# EAGLE schematic vu_meter (EAGLE 8.3.2)
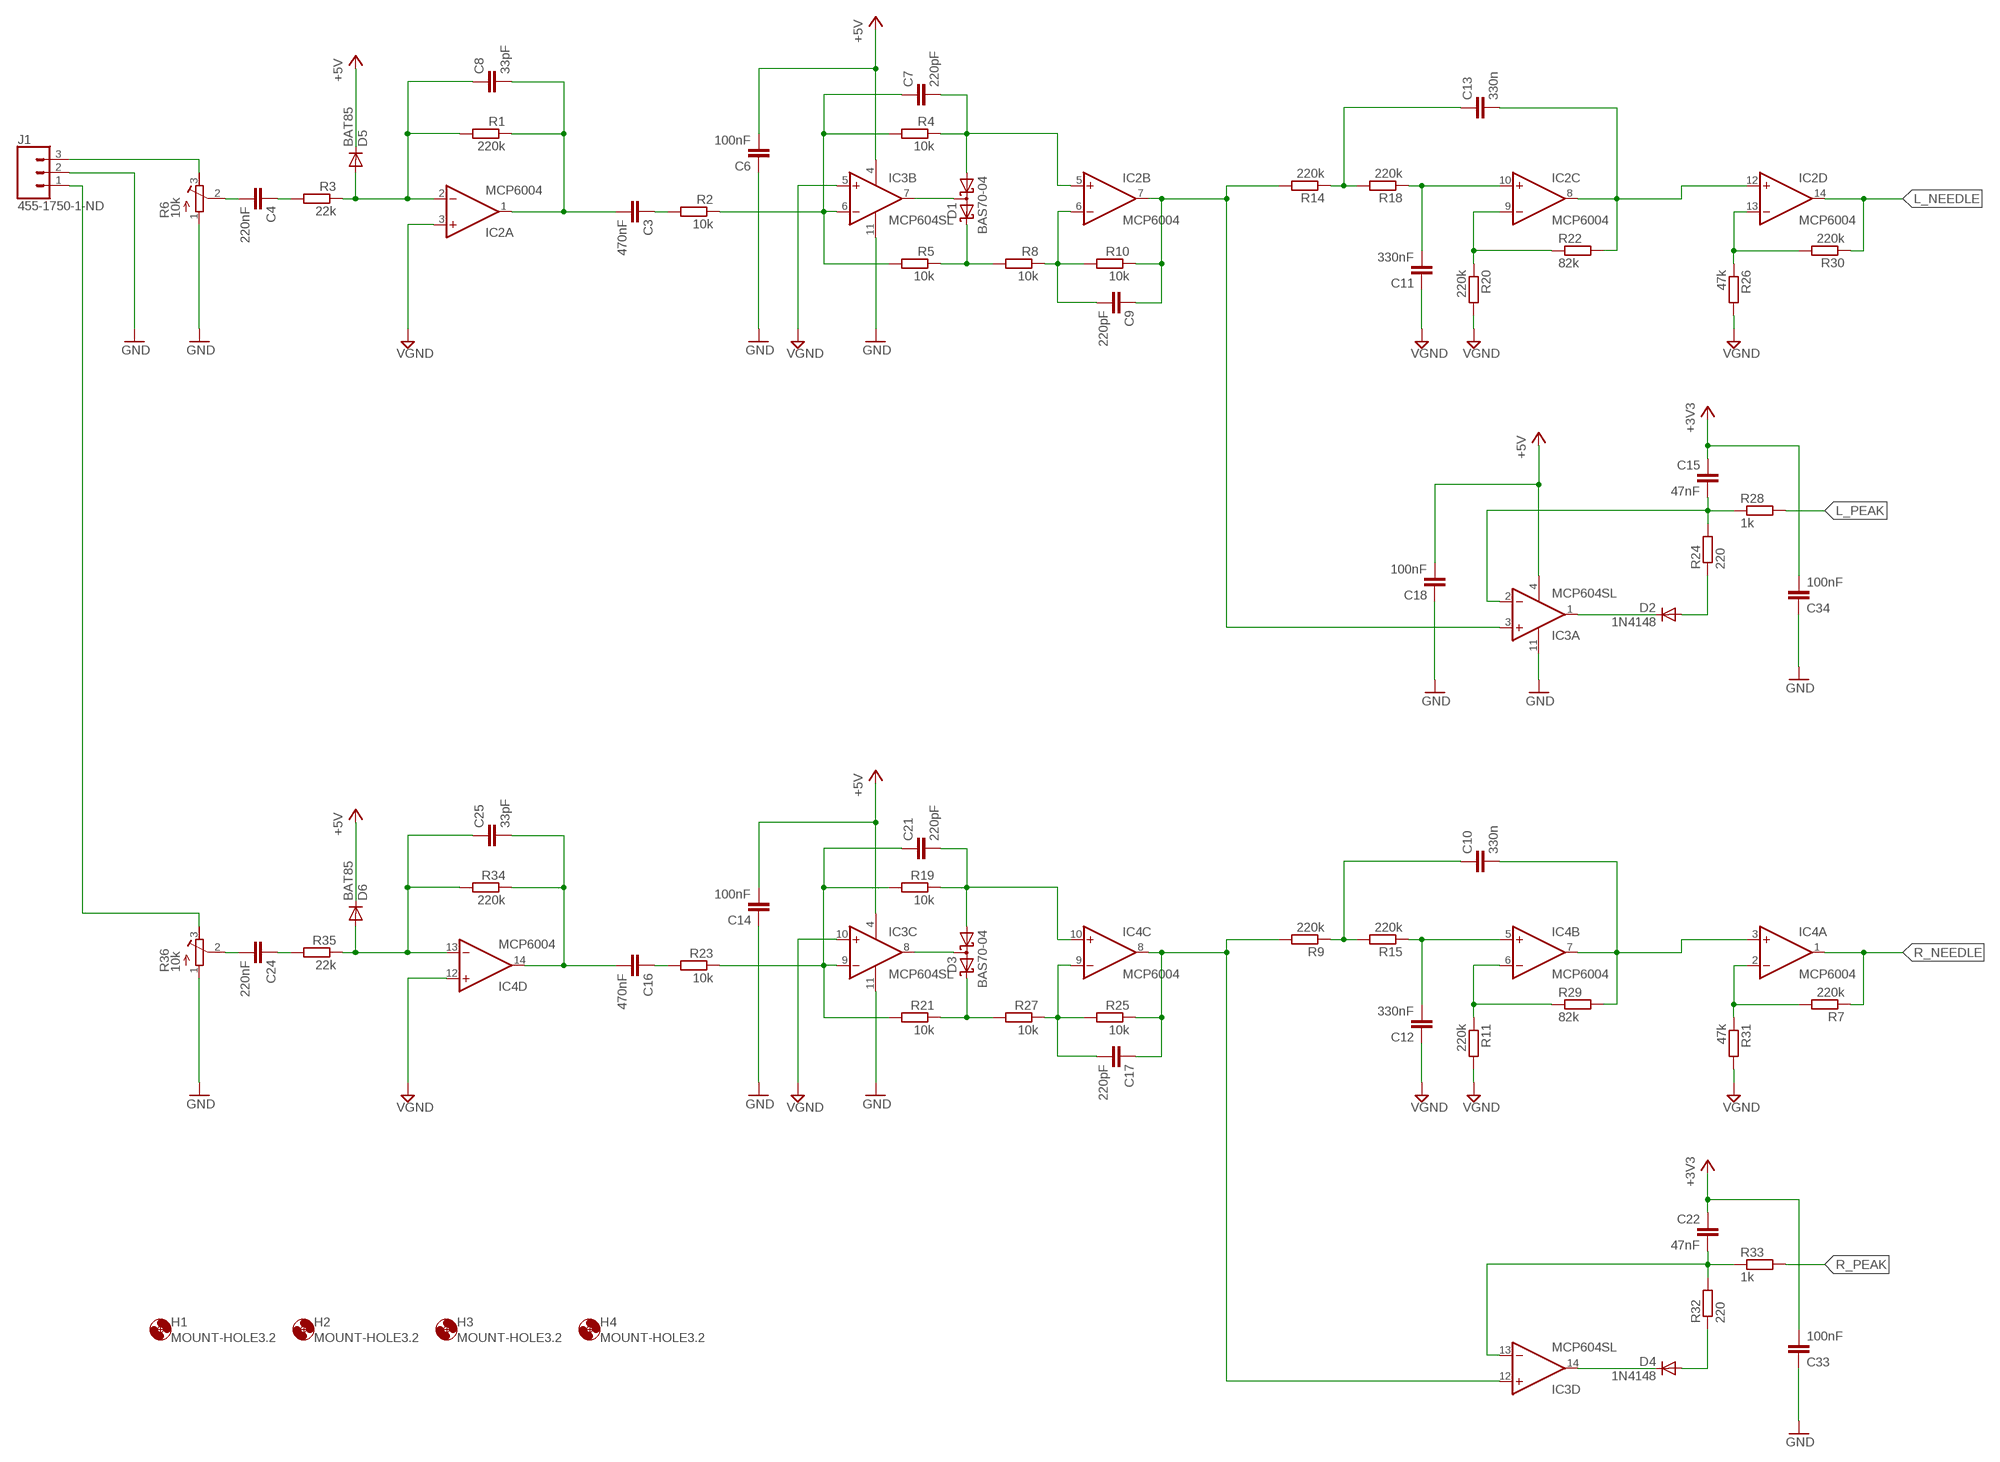
[diagram p0: schematic, sheet 1, part 1 of 2]
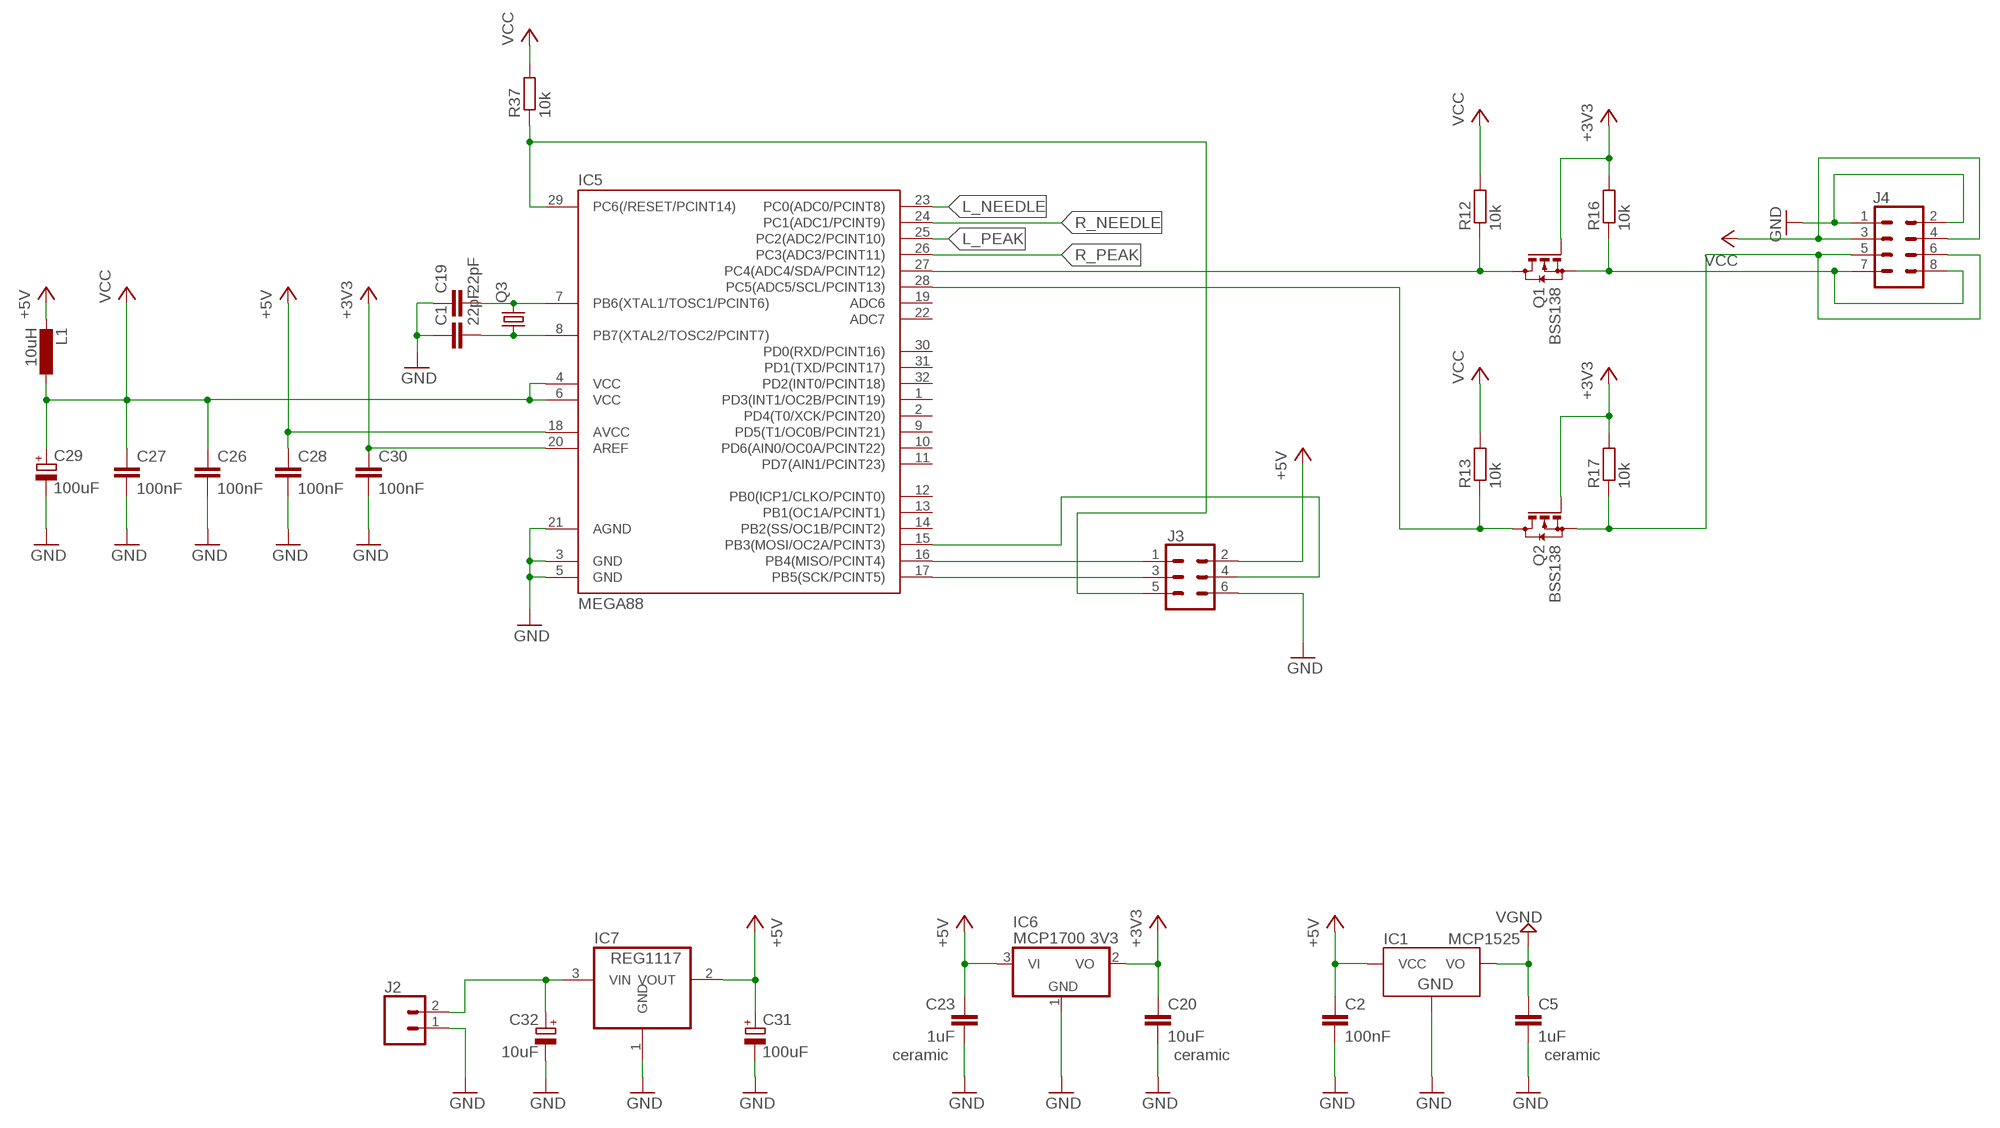
[diagram p1: schematic, sheet 1, part 2 of 2]

## Parts
C1  22pF  C-EUC0805  [C0805]
C2  100nF  C-EUC0805  [C0805]
C3  470nF  C-EUC0805  [C0805]
C4  220nF  C-EUC0805  [C0805]
C5  1uF  C-EUC0805  [C0805]
C6  100nF  C-EUC0805  [C0805]
C7  220pF  C-EUC0805  [C0805]
C8  33pF  C-EUC0805  [C0805]
C9  220pF  C-EUC0805  [C0805]
C10  330n  C-EUC0805  [C0805]
C11  330nF  C-EUC0805  [C0805]
C12  330nF  C-EUC0805  [C0805]
C13  330n  C-EUC0805  [C0805]
C14  100nF  C-EUC0805  [C0805]
C15  47nF  C-EUC0805  [C0805]
C16  470nF  C-EUC0805  [C0805]
C17  220pF  C-EUC0805  [C0805]
C18  100nF  C-EUC0805  [C0805]
C19  22pF  C-EUC0805  [C0805]
C20  10uF  C-EUC0805  [C0805]
C21  220pF  C-EUC0805  [C0805]
C22  47nF  C-EUC0805  [C0805]
C23  1uF  C-EUC0805  [C0805]
C24  220nF  C-EUC0805  [C0805]
C25  33pF  C-EUC0805  [C0805]
C26  100nF  C-EUC0805  [C0805]
C27  100nF  C-EUC0805  [C0805]
C28  100nF  C-EUC0805  [C0805]
C29  100uF  CPOL-EUB/3528-21R  [B/3528-21R]
C30  100nF  C-EUC0805  [C0805]
C31  100uF  CPOL-EUB/3528-21R  [B/3528-21R]
C32  10uF  CPOL-EUB/3528-21R  [B/3528-21R]
C33  100nF  C-EUC0805  [C0805]
C34  100nF  C-EUC0805  [C0805]
D1  BAS70-04  [SOT23]
D2  1N4148  DIODE-MINIMELF  [MINIMELF]
D3  BAS70-04  [SOT23]
D4  1N4148  DIODE-MINIMELF  [MINIMELF]
D5  BAT85  DIODE-MINIMELF  [MINIMELF]
D6  BAT85  DIODE-MINIMELF  [MINIMELF]
H1  MOUNT-HOLE3.2  [3,2]
H2  MOUNT-HOLE3.2  [3,2]
H3  MOUNT-HOLE3.2  [3,2]
H4  MOUNT-HOLE3.2  [3,2]
IC1  MCP1525  MCP9700SMD  [SOT23-3]
IC2  MCP6004  MCP604SL  [SO14]
IC3  MCP604SL  [SO14]
IC4  MCP6004  MCP604SL  [SO14]
IC5  MEGA88  MEGA48/88/168-AU  [TQFP32-08]
IC6  MCP1700 3V3  MCP1703CB  [SOT23]
IC7  REG1117  [SOT223]
J1  455-1750-1-ND  CONN_03  [1X03]
J2  CONN_02  [1X02]
J3  CONN_03X22X3_SILK_MALE_PTH  [2X3]
J4  CONN_04X2  [2X4]
L1  10uH  L-EUL3216C  [L3216C]
Q1  BSS138  BSS123  [SOT23]
Q2  BSS138  BSS123  [SOT23]
Q3  CRYSTALHC49S  [HC49/S]
R1  220k  R-EU_R0805  [R0805]
R2  10k  R-EU_R0805  [R0805]
R3  22k  R-EU_R0805  [R0805]
R4  10k  R-EU_R0805  [R0805]
R5  10k  R-EU_R0805  [R0805]
R6  10k  R-TRIMM3296W  [RTRIM3296W]
R7  220k  R-EU_M0805  [M0805]
R8  10k  R-EU_R0805  [R0805]
R9  220k  R-EU_M0805  [M0805]
R10  10k  R-EU_R0805  [R0805]
R11  220k  R-EU_R0805  [R0805]
R12  10k  R-EU_R0805  [R0805]
R13  10k  R-EU_R0805  [R0805]
R14  220k  R-EU_M0805  [M0805]
R15  220k  R-EU_R0805  [R0805]
R16  10k  R-EU_R0805  [R0805]
R17  10k  R-EU_R0805  [R0805]
R18  220k  R-EU_R0805  [R0805]
R19  10k  R-EU_R0805  [R0805]
R20  220k  R-EU_R0805  [R0805]
R21  10k  R-EU_R0805  [R0805]
R22  82k  R-EU_R0805  [R0805]
R23  10k  R-EU_R0805  [R0805]
R24  220  R-EU_R0805  [R0805]
R25  10k  R-EU_R0805  [R0805]
R26  47k  R-EU_M0805  [M0805]
R27  10k  R-EU_R0805  [R0805]
R28  1k  R-EU_R0805  [R0805]
R29  82k  R-EU_R0805  [R0805]
R30  220k  R-EU_M0805  [M0805]
R31  47k  R-EU_M0805  [M0805]
R32  220  R-EU_R0805  [R0805]
R33  1k  R-EU_R0805  [R0805]
R34  220k  R-EU_R0805  [R0805]
R35  22k  R-EU_R0805  [R0805]
R36  10k  R-TRIMM3296W  [RTRIM3296W]
R37  10k  R-EU_R0805  [R0805]

## Nets
+3V3: C15.1 C20.1 C22.1 C30.1 C33.2 C34.2 IC5.20(AREF) IC6.2(VO) Q1.1(G) Q2.1(G) R16.2 R17.2
+5V: C2.1 C6.2 C14.2 C18.2 C23.1 C28.1 C31.+ D5.C D6.C IC1.1(VCC) IC2.4(P:V+) IC3.4(P:V+) IC4.4(P:V+) IC5.18(AVCC) IC6.3(VI) IC7.2(VOUT) J3.2 L1.2
GND: C1.1 C2.2 C5.2 C6.1 C14.1 C18.1 C19.1 C20.2 C23.2 C26.2 C27.2 C28.2 C29.- C30.2 C31.- C32.- C33.1 C34.1 IC1.3(GND) IC2.11(P:V-) IC3.11(P:V-) IC4.11(P:V-) IC5.3(GND) IC5.5(GND) IC5.21(AGND) IC6.1(GND) IC7.1(GND) J1.2 J2.1 J3.6 J4.1 J4.2 R6.1(A) R36.1(A)
GND1: C5.1 C11.1 C12.1 IC1.2(VO) IC2.3(A:+IN) IC3.5(B:+IN) IC3.10(C:+IN) IC4.12(D:+IN) R11.2 R20.2 R26.2 R31.2 ; supply symbol labelled VGND
IN: J1.3 R6.3(E)
IN1: J1.1 R36.3(E)
L_NEEDLE: IC2.14(D:OUT) IC5.23(PC0(ADC0/PCINT8)) R30.1
L_PEAK: IC5.25(PC2(ADC2/PCINT10)) R28.2
N$1: IC2.13(D:-IN) R26.1 R30.2
N$2: IC4.2(A:-IN) R7.2 R31.1
N$4: C8.1 D5.A IC2.2(A:-IN) R1.2 R3.1
N$5: C4.1 R3.2
N$7: C12.2 IC4.5(B:+IN) R15.1
N$8: C4.2 R6.2(S)
N$9: C13.1 R14.1 R18.2
N$10: C13.2 IC2.8(C:OUT) IC2.12(D:+IN) R22.2
N$11: IC4.6(B:-IN) R11.1 R29.1
N$12: D3.2(C2) R21.1 R27.2
N$13: C21.1 IC3.9(C:-IN) R19.2 R21.2 R23.1
N$14: C11.2 IC2.10(C:+IN) R18.1
N$15: IC2.9(C:-IN) R20.1 R22.1
N$16: D1.2(C2) R5.1 R8.2
N$17: C21.2 D3.1(A1) IC4.10(C:+IN) R19.1
N$18: C3.2 C8.2 IC2.1(A:OUT) R1.1
N$19: C7.1 IC3.6(B:-IN) R2.1 R4.2 R5.2
N$20: D2.C IC3.1(A:OUT)
N$21: D3.3(C1A2) IC3.8(C:OUT)
N$22: C17.2 IC4.9(C:-IN) R25.2 R27.1
N$23: C16.2 C25.2 IC4.14(D:OUT) R34.1
N$24: C16.1 R23.2
N$25: C7.2 D1.1(A1) IC2.5(B:+IN) R4.1
N$26: D1.3(C1A2) IC3.7(B:OUT)
N$27: C9.2 IC2.6(B:-IN) R8.1 R10.2
N$28: C10.1 R9.1 R15.2
N$29: C10.2 IC4.3(A:+IN) IC4.7(B:OUT) R29.2
N$30: C22.2 IC3.13(D:-IN) R32.2 R33.1
N$31: D4.A R32.1
N$32: C17.1 IC3.12(D:+IN) IC4.8(C:OUT) R9.2 R25.1
N$33: D4.C IC3.14(D:OUT)
N$34: C25.1 D6.A IC4.13(D:-IN) R34.2 R35.1
N$35: C24.1 R35.2
N$36: C24.2 R36.2(S)
N$37: C19.2 IC5.7(PB6(XTAL1/TOSC1/PCINT6)) Q3.2
N$38: C1.2 IC5.8(PB7(XTAL2/TOSC2/PCINT7)) Q3.1
N$39: IC5.15(PB3(MOSI/OC2A/PCINT3)) J3.4
N$40: C3.1 R2.2
N$41: IC5.17(PB5(SCK/PCINT5)) J3.3
N$42: IC5.16(PB4(MISO/PCINT4)) J3.1
N$43: IC5.29(PC6(/RESET/PCINT14)) J3.5 R37.1
N$44: C15.2 IC3.2(A:-IN) R24.2 R28.1
N$45: D2.A R24.1
N$47: C32.+ IC7.3(VIN) J2.2
N$48: C9.1 IC2.7(B:OUT) IC3.3(A:+IN) R10.1 R14.2
R_NEEDLE: IC4.1(A:OUT) IC5.24(PC1(ADC1/PCINT9)) R7.1
R_PEAK: IC5.26(PC3(ADC3/PCINT11)) R33.2
SCL: J4.5 J4.6 Q2.2(S) R17.1
SCL1: IC5.28(PC5(ADC5/SCL/PCINT13)) Q2.3(D) R13.1
SDA: J4.7 J4.8 Q1.2(S) R16.1
SDA1: IC5.27(PC4(ADC4/SDA/PCINT12)) Q1.3(D) R12.1
VCC: C26.1 C27.1 C29.+ IC5.4(VCC) IC5.6(VCC) J4.3 J4.4 L1.1 R12.2 R13.2 R37.2
Unconnected: IC5.1(PD3(INT1/OC2B/PCINT19)) IC5.2(PD4(T0/XCK/PCINT20)) IC5.9(PD5(T1/OC0B/PCINT21)) IC5.10(PD6(AIN0/OC0A/PCINT22)) IC5.11(PD7(AIN1/PCINT23)) IC5.12(PB0(ICP1/CLKO/PCINT0)) IC5.13(PB1(OC1A/PCINT1)) IC5.14(PB2(SS/OC1B/PCINT2)) IC5.19(ADC6) IC5.22(ADC7) IC5.30(PD0(RXD/PCINT16)) IC5.31(PD1(TXD/PCINT17)) IC5.32(PD2(INT0/PCINT18))

## Library data of the parts
C1-C4 C6-C19 C21 C22 C24-C28 C30 C33 C34 = rcl:C-EU: CAPACITOR, European symbol
C5 C20 C23 = rcl:C-EU: CAPACITOR, European symbol; TYPE: ceramic
C29 C31 C32 = rcl:CPOL-EU: POLARIZED CAPACITOR, European symbol
D1 D3 = diode:BAS70-04: Silicon Schottky Diodes General-purpose diode for high-speed switching
D2 D4-D6 = diode:DIODE-: DIODE
H1-H4 = holes:MOUNT-HOLE: MOUNTING HOLE with drill center marker
IC1 = SparkFun:MCP9700
IC2-IC4 = linear:MCP604: Quad Op Amp 2.7V to 6.0V Single Supply CMOS Source: http://ww1.microchip.com/downloads/en/DeviceDoc/21314g.pdf
IC5 = avr-7:MEGA48/88/168
IC6 = linear:MCP1703: 250 mA, 16V, Low Quiescent Current LDO Regulator Source: http://ww1.microchip.com/downloads/en/DeviceDoc/22049b.pdf
IC7 = burr-brown:REG1117: 800mA and 1A Low Dropout (LDO) Positive Regulator 1.8V, 2.5V, 2.85V, 3.3V, 5V, and Adj; MPN: REG1117; OC_FARNELL: 1097566; OC_NEWARK: 14P6981
J1 = SparkFun-Connectors:CONN_03: Multi connection point. Often used as Generic Header-pin footprint for 0.1 inch spaced/style header connections On any of the 0.1 inch spaced packages, you can populate with these: Break Away Headers - Straight <https://www.sparkfun.com/products/116> (PRT-00116) Break Away Male Headers - Right Angle <https://www.sparkfun.com/products/553> (PRT-00553) Female Headers <https://www.sparkfun.com/products/115> (PRT-00115) Break Away Headers - Machine Pin <https://www.sparkfun.com/products/117> (PRT-00117) Break Away Female Headers - Swiss Machine Pin <https://www.sparkfun.com/products/743> (PRT-00743) Stackable Header - 3 Pin (Female, 0.1") <https://www.sparkfun.com/products/13875> (PRT-13875) For SCREWTERMINALS and SPRING TERMINALS visit here: Screw Terimnals on SparkFun.com <https://www.sparkfun.com/search/results?term=Screw+Terminals> (5mm/3.5mm/2.54mm spacing) This device is also useful as a general connection point to wire up your design to another part of your project. Our various solder wires solder well into these plated through hole pads. Hook-Up Wire - Assortment (Stranded, 22 AWG) <https://www.sparkfun.com/products/11375> (PRT-11375) Hook-Up Wire - Assortment (Solid Core, 22 AWG) <https://www.sparkfun.com/products/11367> (PRT-11367) View the entire wire category on our website here <https://www.sparkfun.com/categories/141> Special notes: Molex polarized connector foot print use with SKU : PRT-08232 with associated crimp pins and housings.; PROD_ID: XXX-00000
J2 = SparkFun-Connectors:CONN_02: Multi connection point. Often used as Generic Header-pin footprint for 0.1 inch spaced/style header connections On any of the 0.1 inch spaced packages, you can populate with these: Break Away Headers - Straight <https://www.sparkfun.com/products/116> (PRT-00116) Break Away Male Headers - Right Angle <https://www.sparkfun.com/products/553> (PRT-00553) Female Headers <https://www.sparkfun.com/products/115> (PRT-00115) Break Away Headers - Machine Pin <https://www.sparkfun.com/products/117> (PRT-00117) Break Away Female Headers - Swiss Machine Pin <https://www.sparkfun.com/products/743> (PRT-00743) For SCREWTERMINALS and SPRING TERMINALS visit here: Screw Terimnals on SparkFun.com <https://www.sparkfun.com/search/results?term=Screw+Terminals> (5mm/3.5mm/2.54mm spacing) This device is also useful as a general connection point to wire up your design to another part of your project. Our various solder wires solder well into these plated through hole pads. Hook-Up Wire - Assortment (Stranded, 22 AWG) <https://www.sparkfun.com/products/11375> (PRT-11375) Hook-Up Wire - Assortment (Solid Core, 22 AWG) <https://www.sparkfun.com/products/11367> (PRT-11367) View the entire wire category on our website here <https://www.sparkfun.com/categories/141> Special notes: Molex polarized connector foot print use with: PRT-08233 with associated crimp pins and housings. 2.54_SCREWTERM for use with PRT-10571. 3.5mm Screw Terminal footprints for PRT-08084 5mm Screw Terminal footprints for use with PRT-08432
J3 = SparkFun-Connectors:CONN_03X2: Multi connection point. Often used as Generic Header-pin footprint for 0.1 inch spaced/style header connections You can populate with any combo of single row headers, but if you'd like an exact match, check these: Header - 2x3 (Male, 0.1") <https://www.sparkfun.com/products/12807> (PRT-12807) Header - 2x3 (Female, 0.1") <https://www.sparkfun.com/products/13010> (PRT-13010) 2x3 Pin Shrouded Header <https://www.sparkfun.com/products/10877> (PRT-10877) On any of the 0.1 inch spaced packages, you can populate with these: Break Away Headers - Straight <https://www.sparkfun.com/products/116> (PRT-00116) Break Away Male Headers - Right Angle <https://www.sparkfun.com/products/553> (PRT-00553) Female Headers <https://www.sparkfun.com/products/115> (PRT-00115) Break Away Headers - Machine Pin <https://www.sparkfun.com/products/117> (PRT-00117) Break Away Female Headers - Swiss Machine Pin <https://www.sparkfun.com/products/743> (PRT-00743) Special note: the shrouded connector mates well with our 3x2 ribbon cables: Ribbon Crimp Connector - 6-pin (2x3, Female) <https://www.sparkfun.com/products/10651> (PRT-10651) Ribbon Cable - 6 wire (15ft) <https://www.sparkfun.com/products/10646> (PRT-10646); PROD_ID: CONN-09701
J4 = SparkFun-Connectors:CONN_04X2: Multi connection point. Often used as Generic Header-pin footprint for 0.1 inch spaced/style header connections On any of the 0.1 inch spaced packages, you can populate with these: Break Away Headers - Straight <https://www.sparkfun.com/products/116> (PRT-00116) Break Away Male Headers - Right Angle <https://www.sparkfun.com/products/553> (PRT-00553) Female Headers <https://www.sparkfun.com/products/115> (PRT-00115) Break Away Headers - Machine Pin <https://www.sparkfun.com/products/117> (PRT-00117) Break Away Female Headers - Swiss Machine Pin <https://www.sparkfun.com/products/743> (PRT-00743)
L1 = rcl:L-EU: INDUCTOR, European symbol
Q1 Q2 = transistor-small-signal:BSS123: N-CHANNEL MOS FET
Q3 = crystal:CRYSTAL: CRYSTAL; OC_FARNELL: 1667008; OC_NEWARK: unknown
R1-R5 R7-R35 R37 = rcl:R-EU_: RESISTOR, European symbol
R6 R36 = rcl:R-TRIMM: Trimm resistor

## Module BALLISTICS
Ports: INPUT(io) OUTPUT(io)

### Library data of the parts